# Altium schematic sheet Sheet1.SchDoc
size A4
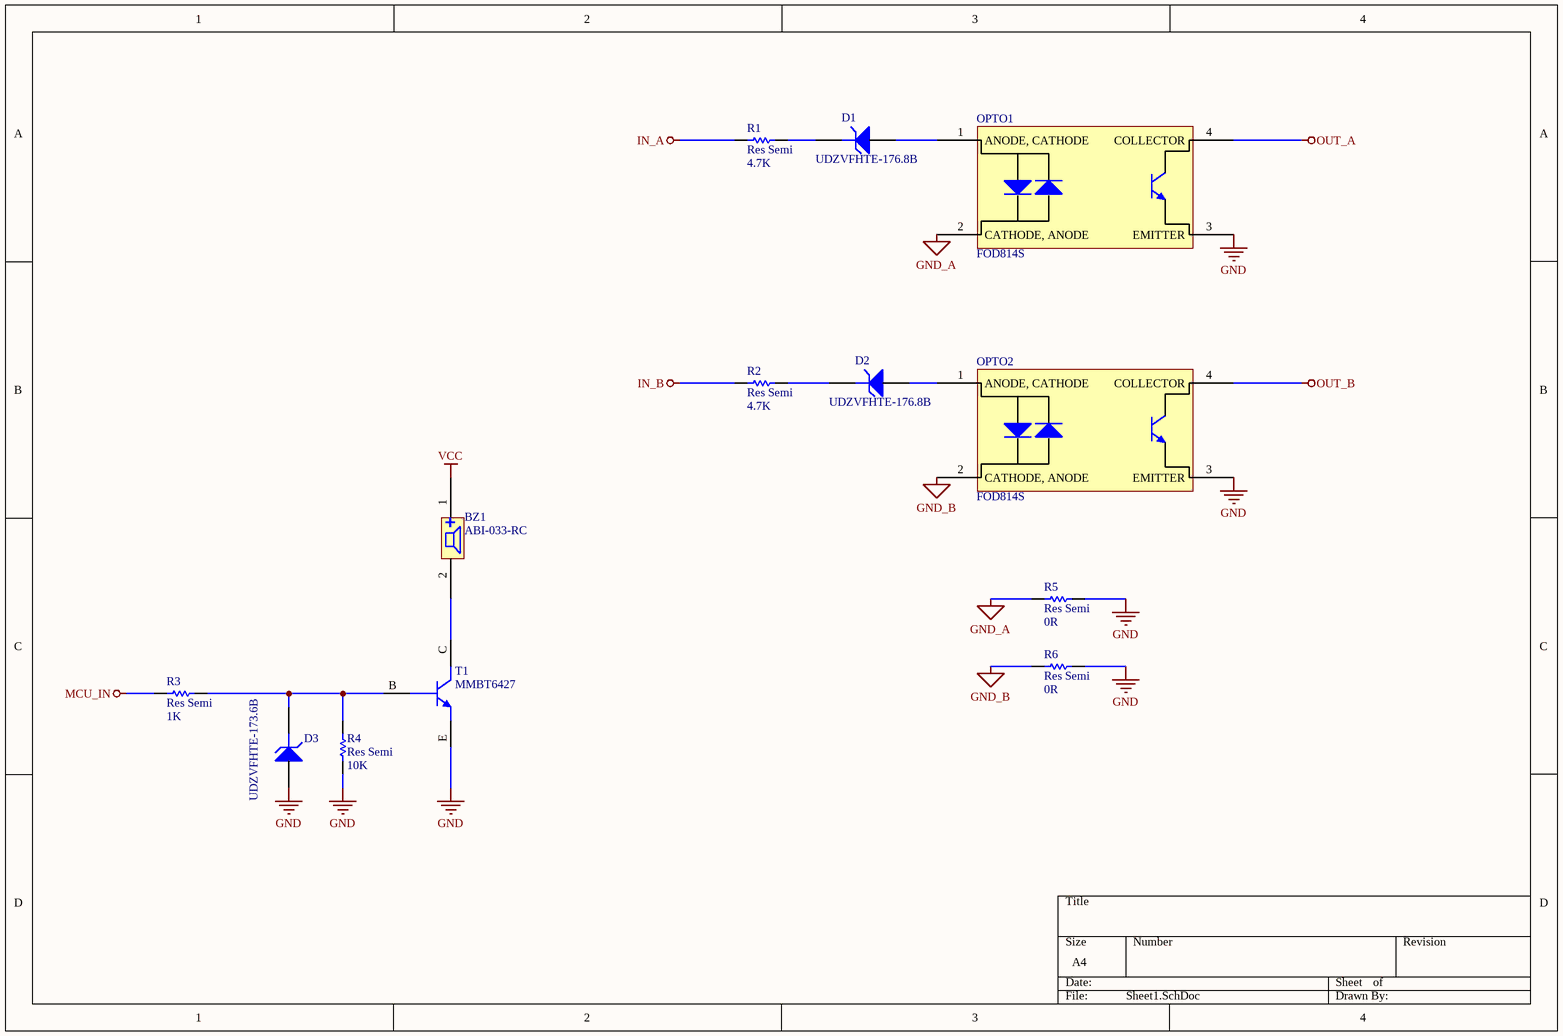
[diagram p0: Sheet1.SchDoc]

## Parts
BZ1  ABI-033-RC  [ABI-033-RC]
D1  UDZVFHTE-176.8B  [UDZVFHTE-176.8B]
D2  UDZVFHTE-176.8B  [UDZVFHTE-176.8B]
D3  UDZVFHTE-173.6B  [UDZVFHTE-176.8B]
OPTO1  FOD814S  [FOD814]
OPTO2  FOD814S  [FOD814]
R1  Res Semi  value 4.7K  [2012[0805]]
R2  Res Semi  value 4.7K  [2012[0805]]
R3  Res Semi  value 1K  [2012[0805]]
R4  Res Semi  value 10K  [2012[0805]]
R5  Res Semi  value 0R  [2012[0805]]
R6  Res Semi  value 0R  [2012[0805]]
T1  MMBT6427  [MMBT6427]

## Nets
GND: D3.2(A) OPTO1.3(EMITTER) OPTO2.3(EMITTER) R4.1 R5.2 R6.2 T1.E
GND_A: OPTO1.2(CATHODE,_ANODE) R5.1
GND_B: OPTO2.2(CATHODE,_ANODE) R6.1
IN_A: R1.1
IN_B: R2.1
MCU_IN: R3.1
OUT_A: OPTO1.4(COLLECTOR)
OUT_B: OPTO2.4(COLLECTOR)
VCC: BZ1.1
NetBZ1_2: BZ1.2 T1.C
NetD1_1: D1.1(K) R1.2
NetD1_2: D1.2(A) OPTO1.1(ANODE,_CATHODE)
NetD2_1: D2.1(K) R2.2
NetD2_2: D2.2(A) OPTO2.1(ANODE,_CATHODE)
NetD3_1: D3.1(K) R3.2 R4.2 T1.B

## Notes on the sheet
- (in symbol ABI-033-RC) +

## Library data of the parts
BZ1 = ABI-033-RC: Manufacturer: PRO SIGNAL; Manufacturer Part No: ABI-033-RC; Component Type: Buzzer; Supplier: *; Order Code: *
D3 = UDZVFHTE-176.8B: Manufacturer: *; Manufacturer Part No: *; Component Type: *; Supplier: *; Order Code: *
OPTO1 OPTO2 = FOD814S: AC Phototransistor Optocoupler; Manufacturer: Fairchild Semiconductor; Manufacturer Part Number: FOD814S
R1-R6 = Res Semi: Semiconductor Resistor; Published: 8-Jun-2000; LatestRevisionDate: 17-Jul-2002; LatestRevisionNote: Re-released for DXP Platform.; PackageReference: AXIAL-0.5; Publisher: Altium Limited
T1 = MMBT6427: Manufacturer: ON SEMICONDUCTOR/FAIRCHILD; Component Type: Darlinghton; Manufacturer Part No: MMBT6427; Supplier: *; Order Code: *
D1 D2 = UDZVFHTE-176.8B: Manufacturer: *; Manufacturer Part No: *; Component Type: *; Supplier: *; Order Code: *